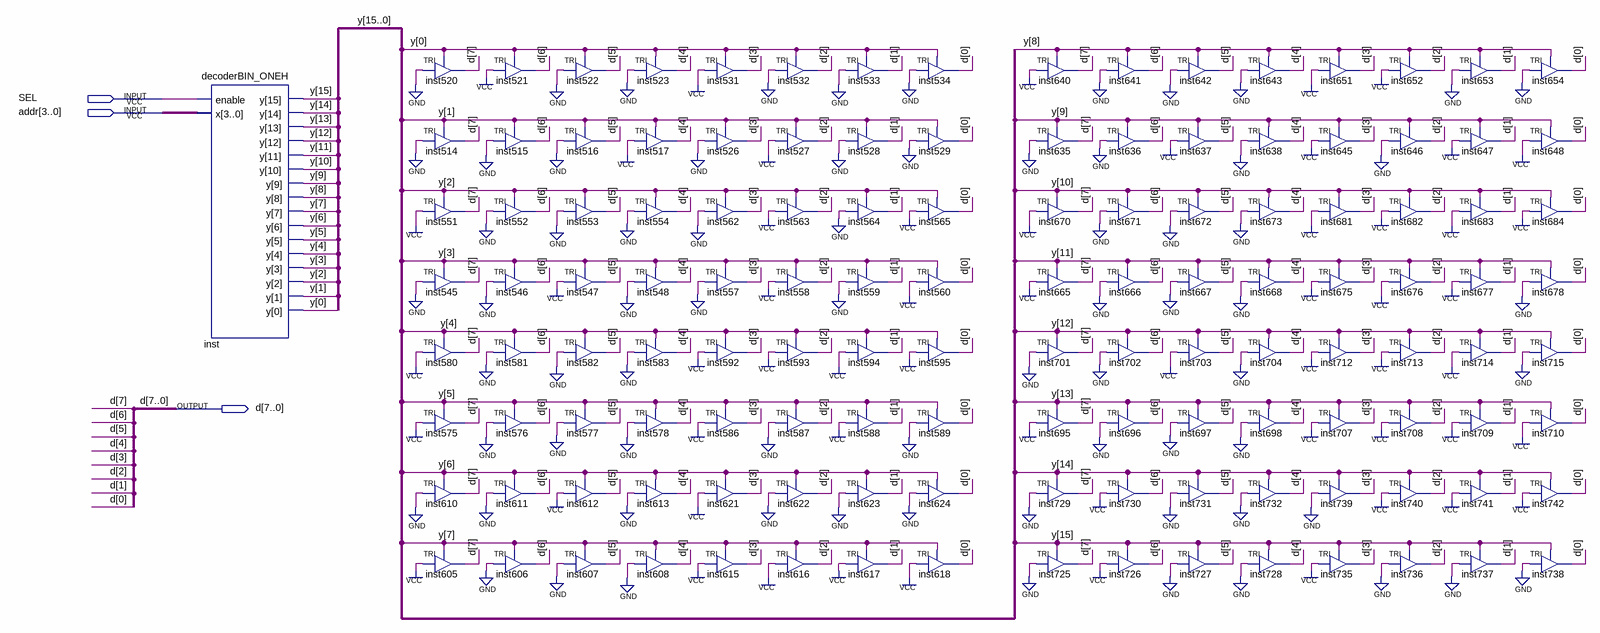
[diagram p0: schematic sheet]
// Quartus schematic rom16x8_22.bdf as structural Verilog: 129 symbols, 3 pins
module rom16x8_22 (
  input  SEL,
  input  [3:0] addr,
  output [7:0] d
);

  wire [15:0] y;

  decoderBIN_ONEH inst (.enable(SEL), .x(addr), .y(y));
  TRI inst520 (.IN(1'b0), .OE(y[0]), .OUT(d[7]));
  TRI inst514 (.IN(1'b0), .OE(y[1]), .OUT(d[7]));
  TRI inst551 (.IN(1'b1), .OE(y[2]), .OUT(d[7]));
  TRI inst545 (.IN(1'b0), .OE(y[3]), .OUT(d[7]));
  TRI inst580 (.IN(1'b1), .OE(y[4]), .OUT(d[7]));
  TRI inst575 (.IN(1'b1), .OE(y[5]), .OUT(d[7]));
  TRI inst610 (.IN(1'b0), .OE(y[6]), .OUT(d[7]));
  TRI inst605 (.IN(1'b1), .OE(y[7]), .OUT(d[7]));
  TRI inst521 (.IN(1'b1), .OE(y[0]), .OUT(d[6]));
  TRI inst515 (.IN(1'b0), .OE(y[1]), .OUT(d[6]));
  TRI inst552 (.IN(1'b0), .OE(y[2]), .OUT(d[6]));
  TRI inst546 (.IN(1'b0), .OE(y[3]), .OUT(d[6]));
  TRI inst581 (.IN(1'b0), .OE(y[4]), .OUT(d[6]));
  TRI inst576 (.IN(1'b0), .OE(y[5]), .OUT(d[6]));
  TRI inst611 (.IN(1'b0), .OE(y[6]), .OUT(d[6]));
  TRI inst606 (.IN(1'b0), .OE(y[7]), .OUT(d[6]));
  TRI inst522 (.IN(1'b0), .OE(y[0]), .OUT(d[5]));
  TRI inst516 (.IN(1'b0), .OE(y[1]), .OUT(d[5]));
  TRI inst553 (.IN(1'b0), .OE(y[2]), .OUT(d[5]));
  TRI inst547 (.IN(1'b1), .OE(y[3]), .OUT(d[5]));
  TRI inst582 (.IN(1'b0), .OE(y[4]), .OUT(d[5]));
  TRI inst577 (.IN(1'b0), .OE(y[5]), .OUT(d[5]));
  TRI inst612 (.IN(1'b1), .OE(y[6]), .OUT(d[5]));
  TRI inst607 (.IN(1'b0), .OE(y[7]), .OUT(d[5]));
  TRI inst523 (.IN(1'b0), .OE(y[0]), .OUT(d[4]));
  TRI inst517 (.IN(1'b1), .OE(y[1]), .OUT(d[4]));
  TRI inst554 (.IN(1'b0), .OE(y[2]), .OUT(d[4]));
  TRI inst548 (.IN(1'b0), .OE(y[3]), .OUT(d[4]));
  TRI inst583 (.IN(1'b0), .OE(y[4]), .OUT(d[4]));
  TRI inst578 (.IN(1'b0), .OE(y[5]), .OUT(d[4]));
  TRI inst613 (.IN(1'b0), .OE(y[6]), .OUT(d[4]));
  TRI inst608 (.IN(1'b0), .OE(y[7]), .OUT(d[4]));
  TRI inst531 (.IN(1'b1), .OE(y[0]), .OUT(d[3]));
  TRI inst526 (.IN(1'b0), .OE(y[1]), .OUT(d[3]));
  TRI inst562 (.IN(1'b0), .OE(y[2]), .OUT(d[3]));
  TRI inst557 (.IN(1'b0), .OE(y[3]), .OUT(d[3]));
  TRI inst592 (.IN(1'b1), .OE(y[4]), .OUT(d[3]));
  TRI inst586 (.IN(1'b1), .OE(y[5]), .OUT(d[3]));
  TRI inst621 (.IN(1'b1), .OE(y[6]), .OUT(d[3]));
  TRI inst615 (.IN(1'b1), .OE(y[7]), .OUT(d[3]));
  TRI inst532 (.IN(1'b0), .OE(y[0]), .OUT(d[2]));
  TRI inst527 (.IN(1'b1), .OE(y[1]), .OUT(d[2]));
  TRI inst563 (.IN(1'b1), .OE(y[2]), .OUT(d[2]));
  TRI inst558 (.IN(1'b1), .OE(y[3]), .OUT(d[2]));
  TRI inst593 (.IN(1'b1), .OE(y[4]), .OUT(d[2]));
  TRI inst587 (.IN(1'b0), .OE(y[5]), .OUT(d[2]));
  TRI inst622 (.IN(1'b0), .OE(y[6]), .OUT(d[2]));
  TRI inst616 (.IN(1'b1), .OE(y[7]), .OUT(d[2]));
  TRI inst533 (.IN(1'b0), .OE(y[0]), .OUT(d[1]));
  TRI inst528 (.IN(1'b0), .OE(y[1]), .OUT(d[1]));
  TRI inst564 (.IN(1'b0), .OE(y[2]), .OUT(d[1]));
  TRI inst559 (.IN(1'b0), .OE(y[3]), .OUT(d[1]));
  TRI inst594 (.IN(1'b1), .OE(y[4]), .OUT(d[1]));
  TRI inst588 (.IN(1'b1), .OE(y[5]), .OUT(d[1]));
  TRI inst623 (.IN(1'b0), .OE(y[6]), .OUT(d[1]));
  TRI inst617 (.IN(1'b1), .OE(y[7]), .OUT(d[1]));
  TRI inst534 (.IN(1'b0), .OE(y[0]), .OUT(d[0]));
  TRI inst529 (.IN(1'b0), .OE(y[1]), .OUT(d[0]));
  TRI inst565 (.IN(1'b1), .OE(y[2]), .OUT(d[0]));
  TRI inst560 (.IN(1'b1), .OE(y[3]), .OUT(d[0]));
  TRI inst595 (.IN(1'b1), .OE(y[4]), .OUT(d[0]));
  TRI inst589 (.IN(1'b0), .OE(y[5]), .OUT(d[0]));
  TRI inst624 (.IN(1'b0), .OE(y[6]), .OUT(d[0]));
  TRI inst618 (.IN(1'b1), .OE(y[7]), .OUT(d[0]));
  TRI inst640 (.IN(1'b1), .OE(y[8]), .OUT(d[7]));
  TRI inst635 (.IN(1'b0), .OE(y[9]), .OUT(d[7]));
  TRI inst670 (.IN(1'b1), .OE(y[10]), .OUT(d[7]));
  TRI inst665 (.IN(1'b1), .OE(y[11]), .OUT(d[7]));
  TRI inst701 (.IN(1'b0), .OE(y[12]), .OUT(d[7]));
  TRI inst695 (.IN(1'b1), .OE(y[13]), .OUT(d[7]));
  TRI inst729 (.IN(1'b0), .OE(y[14]), .OUT(d[7]));
  TRI inst725 (.IN(1'b0), .OE(y[15]), .OUT(d[7]));
  TRI inst641 (.IN(1'b0), .OE(y[8]), .OUT(d[6]));
  TRI inst636 (.IN(1'b0), .OE(y[9]), .OUT(d[6]));
  TRI inst671 (.IN(1'b0), .OE(y[10]), .OUT(d[6]));
  TRI inst666 (.IN(1'b0), .OE(y[11]), .OUT(d[6]));
  TRI inst702 (.IN(1'b0), .OE(y[12]), .OUT(d[6]));
  TRI inst696 (.IN(1'b0), .OE(y[13]), .OUT(d[6]));
  TRI inst730 (.IN(1'b1), .OE(y[14]), .OUT(d[6]));
  TRI inst726 (.IN(1'b1), .OE(y[15]), .OUT(d[6]));
  TRI inst642 (.IN(1'b0), .OE(y[8]), .OUT(d[5]));
  TRI inst637 (.IN(1'b1), .OE(y[9]), .OUT(d[5]));
  TRI inst672 (.IN(1'b0), .OE(y[10]), .OUT(d[5]));
  TRI inst667 (.IN(1'b0), .OE(y[11]), .OUT(d[5]));
  TRI inst703 (.IN(1'b1), .OE(y[12]), .OUT(d[5]));
  TRI inst697 (.IN(1'b0), .OE(y[13]), .OUT(d[5]));
  TRI inst731 (.IN(1'b0), .OE(y[14]), .OUT(d[5]));
  TRI inst727 (.IN(1'b0), .OE(y[15]), .OUT(d[5]));
  TRI inst643 (.IN(1'b0), .OE(y[8]), .OUT(d[4]));
  TRI inst638 (.IN(1'b0), .OE(y[9]), .OUT(d[4]));
  TRI inst673 (.IN(1'b0), .OE(y[10]), .OUT(d[4]));
  TRI inst668 (.IN(1'b0), .OE(y[11]), .OUT(d[4]));
  TRI inst704 (.IN(1'b0), .OE(y[12]), .OUT(d[4]));
  TRI inst698 (.IN(1'b0), .OE(y[13]), .OUT(d[4]));
  TRI inst732 (.IN(1'b0), .OE(y[14]), .OUT(d[4]));
  TRI inst728 (.IN(1'b0), .OE(y[15]), .OUT(d[4]));
  TRI inst651 (.IN(1'b1), .OE(y[8]), .OUT(d[3]));
  TRI inst645 (.IN(1'b1), .OE(y[9]), .OUT(d[3]));
  TRI inst681 (.IN(1'b1), .OE(y[10]), .OUT(d[3]));
  TRI inst675 (.IN(1'b1), .OE(y[11]), .OUT(d[3]));
  TRI inst712 (.IN(1'b1), .OE(y[12]), .OUT(d[3]));
  TRI inst707 (.IN(1'b1), .OE(y[13]), .OUT(d[3]));
  TRI inst739 (.IN(1'b0), .OE(y[14]), .OUT(d[3]));
  TRI inst735 (.IN(1'b1), .OE(y[15]), .OUT(d[3]));
  TRI inst652 (.IN(1'b1), .OE(y[8]), .OUT(d[2]));
  TRI inst646 (.IN(1'b0), .OE(y[9]), .OUT(d[2]));
  TRI inst682 (.IN(1'b1), .OE(y[10]), .OUT(d[2]));
  TRI inst676 (.IN(1'b1), .OE(y[11]), .OUT(d[2]));
  TRI inst713 (.IN(1'b1), .OE(y[12]), .OUT(d[2]));
  TRI inst708 (.IN(1'b1), .OE(y[13]), .OUT(d[2]));
  TRI inst740 (.IN(1'b1), .OE(y[14]), .OUT(d[2]));
  TRI inst736 (.IN(1'b0), .OE(y[15]), .OUT(d[2]));
  TRI inst653 (.IN(1'b0), .OE(y[8]), .OUT(d[1]));
  TRI inst647 (.IN(1'b1), .OE(y[9]), .OUT(d[1]));
  TRI inst683 (.IN(1'b1), .OE(y[10]), .OUT(d[1]));
  TRI inst677 (.IN(1'b1), .OE(y[11]), .OUT(d[1]));
  TRI inst714 (.IN(1'b1), .OE(y[12]), .OUT(d[1]));
  TRI inst709 (.IN(1'b1), .OE(y[13]), .OUT(d[1]));
  TRI inst741 (.IN(1'b1), .OE(y[14]), .OUT(d[1]));
  TRI inst737 (.IN(1'b0), .OE(y[15]), .OUT(d[1]));
  TRI inst654 (.IN(1'b0), .OE(y[8]), .OUT(d[0]));
  TRI inst648 (.IN(1'b1), .OE(y[9]), .OUT(d[0]));
  TRI inst684 (.IN(1'b1), .OE(y[10]), .OUT(d[0]));
  TRI inst678 (.IN(1'b0), .OE(y[11]), .OUT(d[0]));
  TRI inst715 (.IN(1'b0), .OE(y[12]), .OUT(d[0]));
  TRI inst710 (.IN(1'b1), .OE(y[13]), .OUT(d[0]));
  TRI inst742 (.IN(1'b1), .OE(y[14]), .OUT(d[0]));
  TRI inst738 (.IN(1'b0), .OE(y[15]), .OUT(d[0]));
endmodule
